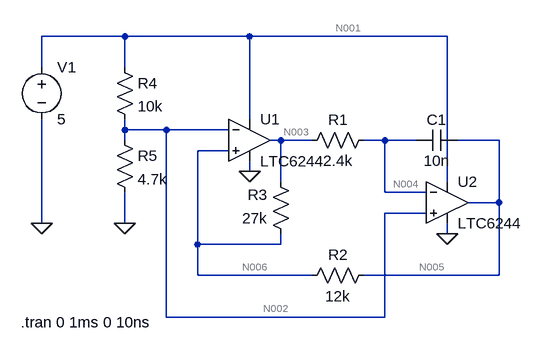
[diagram p0: schematic Triangle Wave Gen.asc]
Triangle Wave Gen.asc, the LTspice schematic file:
Version 4
SHEET 1 880 680
WIRE -80 -16 -208 -16
WIRE 112 -16 -80 -16
WIRE 416 -16 112 -16
WIRE -208 32 -208 -16
WIRE -80 32 -80 -16
WIRE 112 112 112 -16
WIRE -80 128 -80 112
WIRE -16 128 -80 128
WIRE 80 128 -16 128
WIRE -80 144 -80 128
WIRE 160 144 144 144
WIRE 208 144 160 144
WIRE 320 144 288 144
WIRE 368 144 320 144
WIRE 496 144 432 144
WIRE 80 160 32 160
WIRE 112 192 112 176
WIRE 160 208 160 144
WIRE 416 208 416 -16
WIRE 320 224 320 144
WIRE 384 224 320 224
WIRE 496 240 496 144
WIRE 496 240 448 240
WIRE 384 256 320 256
WIRE -208 272 -208 112
WIRE -80 272 -80 224
WIRE 416 288 416 272
WIRE 32 304 32 160
WIRE 160 304 160 288
WIRE 160 304 32 304
WIRE 32 352 32 304
WIRE 208 352 32 352
WIRE 496 352 496 240
WIRE 496 352 288 352
WIRE -16 416 -16 128
WIRE 320 416 320 256
WIRE 320 416 -16 416
FLAG -80 272 0
FLAG 112 192 0
FLAG 416 288 0
FLAG -208 272 0
SYMBOL res 304 128 R90
WINDOW 0 0 56 VBottom 2
WINDOW 3 32 56 VTop 2
SYMATTR InstName R1
SYMATTR Value 2.4k
SYMBOL res 176 304 R180
WINDOW 0 36 76 Left 2
WINDOW 3 36 40 Left 2
SYMATTR InstName R3
SYMATTR Value 27k
SYMBOL res 304 336 R90
WINDOW 0 0 56 VBottom 2
WINDOW 3 32 56 VTop 2
SYMATTR InstName R2
SYMATTR Value 12k
SYMBOL cap 432 128 R90
WINDOW 0 0 32 VBottom 2
WINDOW 3 32 32 VTop 2
SYMATTR InstName C1
SYMATTR Value 10n
SYMBOL res -96 16 R0
SYMATTR InstName R4
SYMATTR Value 10k
SYMBOL res -96 128 R0
SYMATTR InstName R5
SYMATTR Value 4.7k
SYMBOL voltage -208 16 R0
SYMATTR InstName V1
SYMATTR Value 5
SYMBOL OpAmps\\LTC6244 112 144 R0
SYMATTR InstName U1
SYMBOL OpAmps\\LTC6244 416 240 R0
SYMATTR InstName U2
TEXT -240 424 Left 2 !.tran 0 1ms 0 10ns

The netlist it stands for:
* Triangle Wave Gen.asc
R1 N004 N003 2.4k
R3 N006 N003 27k
R2 N005 N006 12k
C1 N005 N004 10n
R4 N001 N002 10k
R5 N002 0 4.7k
V1 N001 0 5
XU1 N006 N002 N001 0 N003 LTC6244  ; pins In+ In- V+ V- OUT
XU2 N002 N004 N001 0 N005 LTC6244  ; pins In+ In- V+ V- OUT
.tran 0 1ms 0 10ns
.backanno
.end

* Results of the author's LTspice run, read from the files saved beside the schematic
* Operating Point, zero values left out:
*   V(n004) = 1.599 V
*   V(n003) = 1.599 V
*   V(n006) = 1.599 V
*   V(n005) = 1.599 V
*   V(n001) = 5 V
*   V(n002) = 1.599 V
*   I(R5) = 340.1 µA
*   I(R4) = 340.1 µA
*   I(R2) = -33.09 pA
*   I(R3) = -33.09 pA
*   I(V1) = -11.92 mA
*   Ix(u1:3) = 5.788 mA
*   Ix(u1:4) = -5.788 mA
*   Ix(u1:5) = -31.28 pA
*   Ix(u2:3) = 5.788 mA
*   Ix(u2:4) = -5.788 mA
*   Ix(u2:5) = 34.89 pA
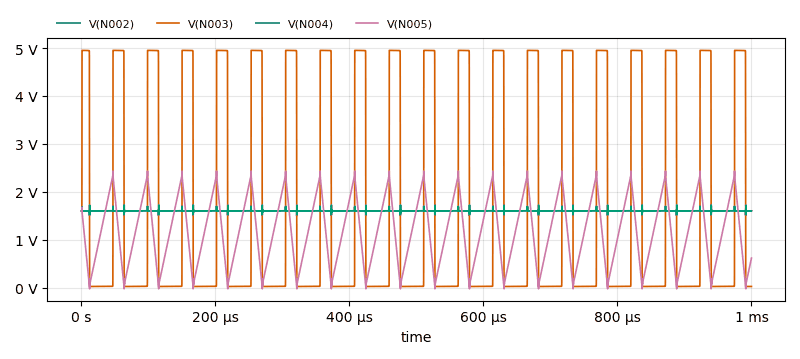
[diagram p1: Transient Analysis of Triangle Wave Gen.asc, plotted from the saved traces]
* Transient Analysis, 1 run:
*   V(N002): min 1.503 V, max 1.692 V, average 1.599 V, rms 1.599 V, last 1.599 V
*   V(N003): min 20.19 mV, max 4.951 V, average 1.622 V, rms 2.814 V, last 21.86 mV
*   V(N004): min 1.518 V, max 1.721 V, average 1.599 V, rms 1.599 V, last 1.599 V
*   V(N005): min -27.1 mV, max 2.43 V, average 1.177 V, rms 1.362 V, last 615.2 mV